# Altium schematic sheet Power_Card.SchDoc
size A3
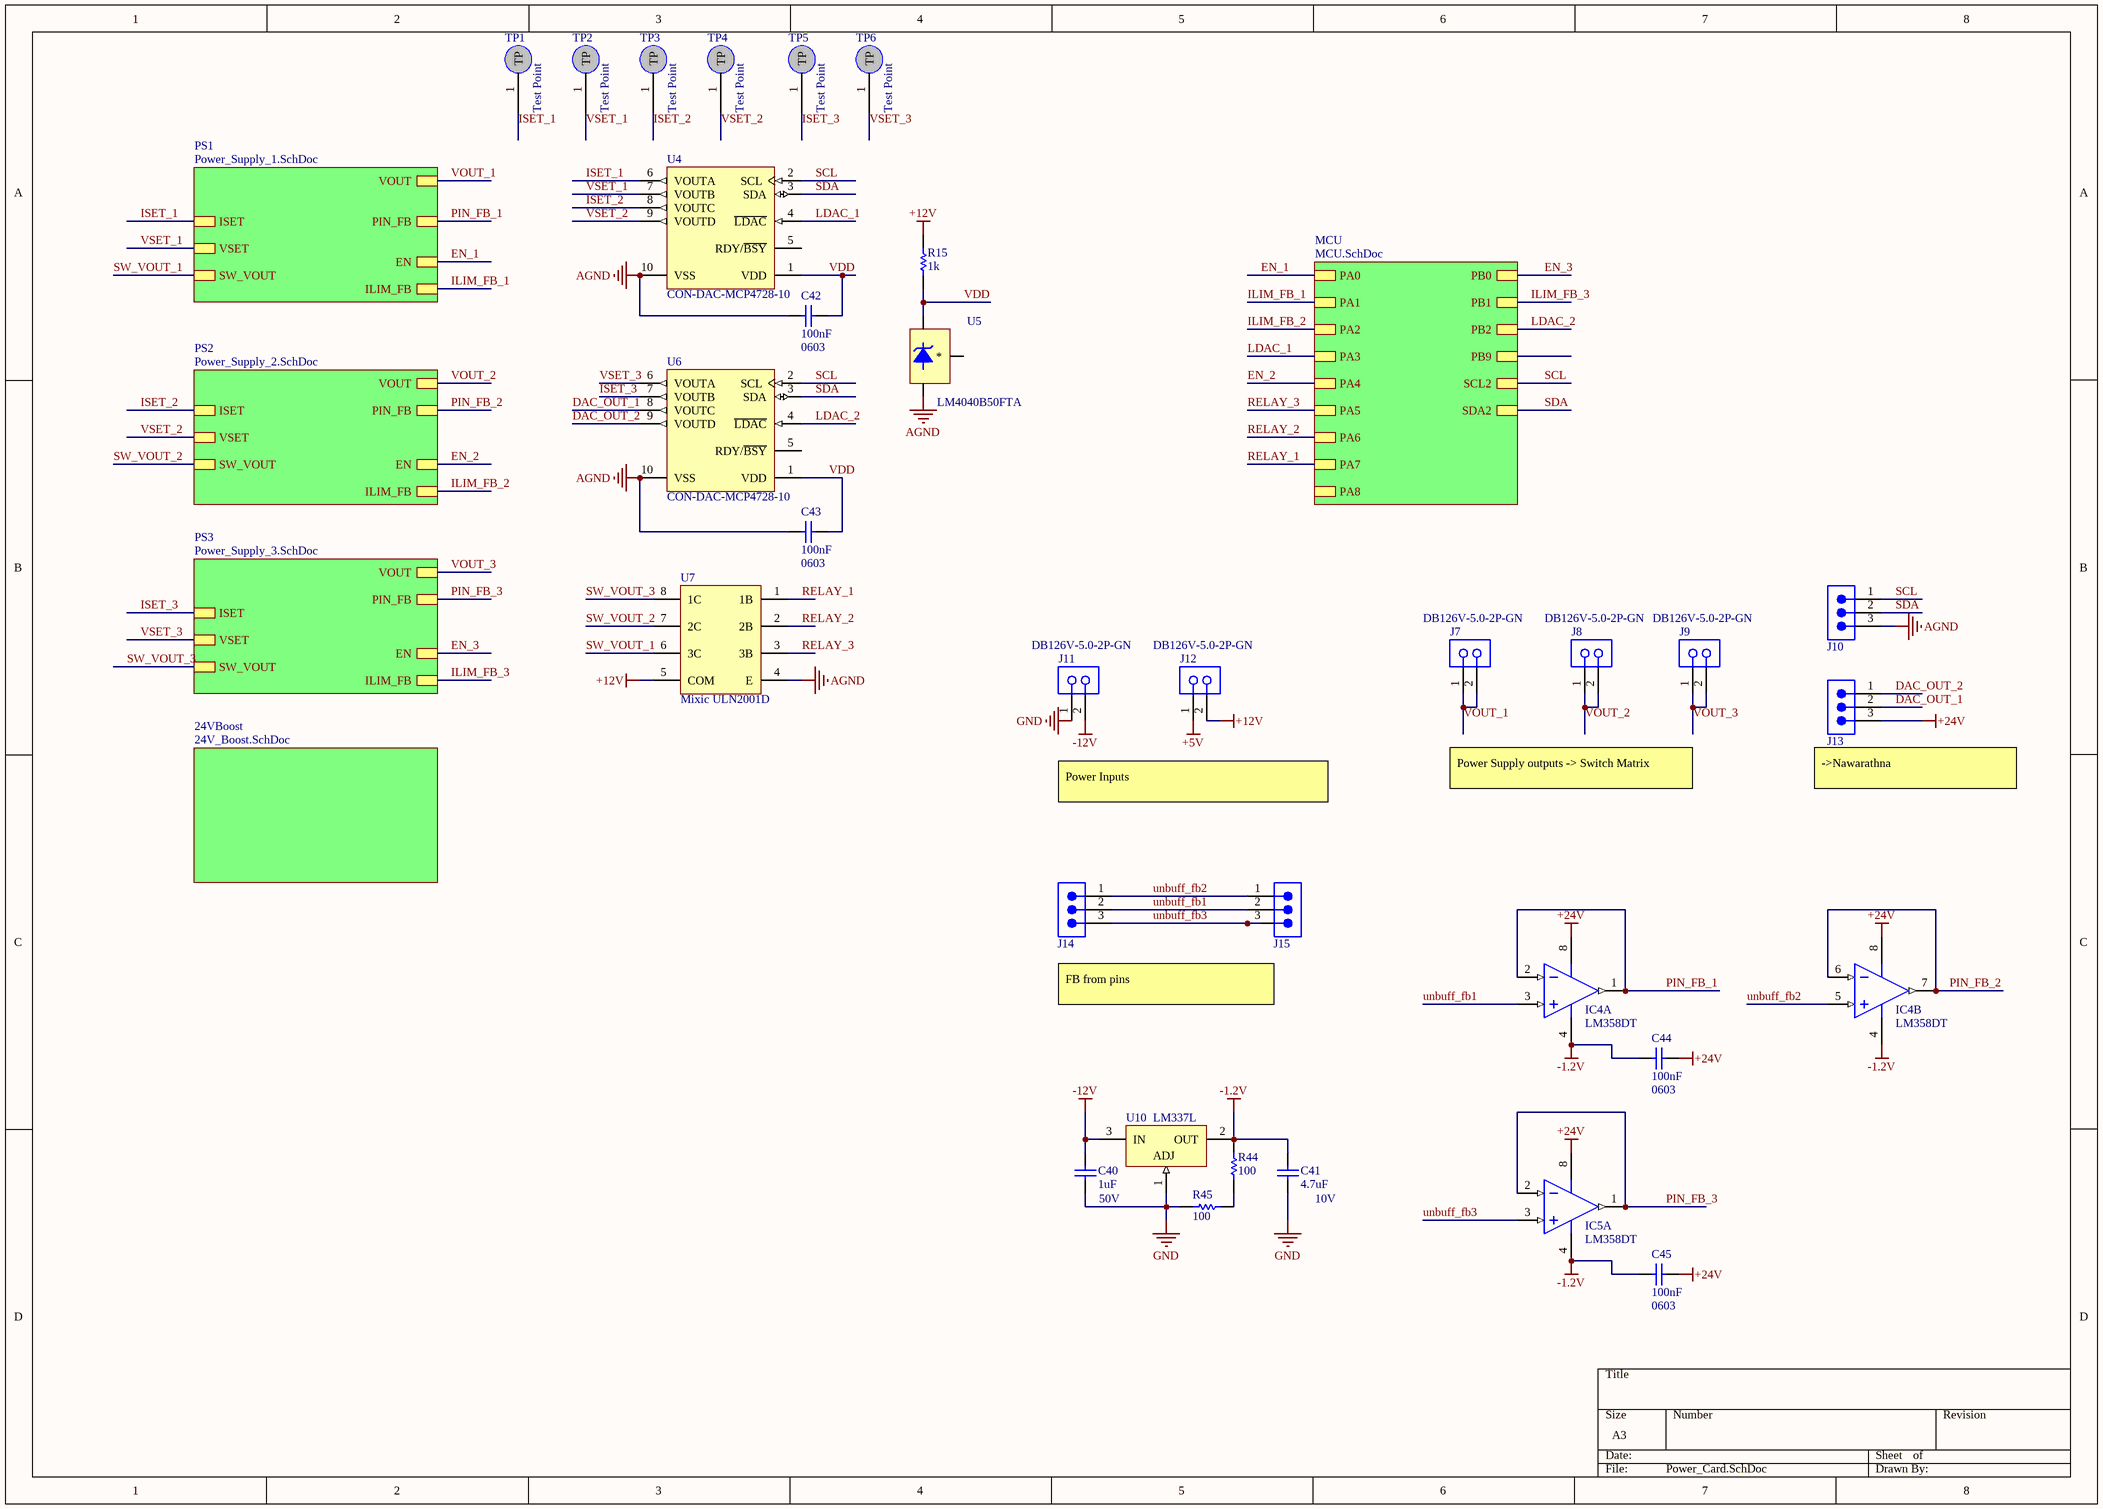
[diagram p0: Power_Card.SchDoc]

## Parts
C40  1uF  Voltage-Rated: 50V  [CAPC1608X09N]
C41  4.7uF  Voltage-Rated: 10V  [CAPC1608X09N]
C42  100nF  Package / Case: 0603  [CAPC1608X09N]
C43  100nF  Package / Case: 0603  [CAPC1608X09N]
C44  100nF  Package / Case: 0603  [CAPC1608X09N]
C45  100nF  Package / Case: 0603  [CAPC1608X09N]
IC4  LM358DT  [SOIC-OA8_M]  (parts A,B of 2)
IC5  LM358DT  [SOIC-OA8_M]  (part A of 2)
J7  DB126V-5.0-2P-GN  [PCB-kiok1jlp9o9fcwf1wwvf-1]
J8  DB126V-5.0-2P-GN  [PCB-kiok1jlp9o9fcwf1wwvf-1]
J9  DB126V-5.0-2P-GN  [PCB-kiok1jlp9o9fcwf1wwvf-1]
J10  M20-9990346  [PIN_3x1_STR (2.54mm)]  (value not drawn)
J11  DB126V-5.0-2P-GN  [PCB-kiok1jlp9o9fcwf1wwvf-1]
J12  DB126V-5.0-2P-GN  [PCB-kiok1jlp9o9fcwf1wwvf-1]
J13  M20-9990346  [PIN_3x1_STR (2.54mm)]  (value not drawn)
J14  M20-9990346  [PIN_3x1_STR (2.54mm)]  (value not drawn)
J15  M20-9990346  [PIN_3x1_STR (2.54mm)]  (value not drawn)
R15  1k  [gen0603-2]
R44  100  [gen0603-2]
R45  100  [gen0603-2]
TP1  Test Point  [PCB-76sf9akqozhr8i1vmz2c-1]
TP2  Test Point  [PCB-76sf9akqozhr8i1vmz2c-1]
TP3  Test Point  [PCB-76sf9akqozhr8i1vmz2c-1]
TP4  Test Point  [PCB-76sf9akqozhr8i1vmz2c-1]
TP5  Test Point  [PCB-76sf9akqozhr8i1vmz2c-1]
TP6  Test Point  [PCB-76sf9akqozhr8i1vmz2c-1]
U4  CON-DAC-MCP4728-10  [PCB-psrfqusngns6snaz1e8o-1]
U5  LM4040B50FTA  [PCB-bxhnyzncanvi69437o7v-1]
U6  CON-DAC-MCP4728-10  [PCB-psrfqusngns6snaz1e8o-1]
U7  Mixic ULN2001D  [PCB-pxs93rufbf6wijgtyo7d-1]
U10  LM337L  [Z03A]

## Sub-sheets
24VBoost = 24V_Boost.SchDoc: no entries
MCU = MCU.SchDoc: PA1, PA8, PB2, PB9, PA7, PA6, PA4, PA2, PA5, PA3, SDA2, PB0, PB1, SCL2, PA0
PS1 = Power_Supply_1.SchDoc: EN, VSET, VOUT, ISET, SW_VOUT, ILIM_FB, PIN_FB
PS2 = Power_Supply_2.SchDoc: VSET, EN, SW_VOUT, VOUT, ISET, ILIM_FB, PIN_FB
PS3 = Power_Supply_3.SchDoc: VSET, EN, SW_VOUT, VOUT, ISET, ILIM_FB, PIN_FB

## Nets
+5V: J12.1
+12V: J12.2 R15.2 U7.5(COM)
+24V: C44.2 C45.2 IC4.8(VCC) IC5.8(VCC) J13.3
-1.2V: C41.2 C44.1 C45.1 IC4.4(VEE/GND) IC5.4(VEE/GND) R44.1 U10.2(OUT)
-12V: C40.2 J11.2 U10.3(IN)
AGND: C42.2 C43.1 J10.3 U4.10(VSS) U5.2(-V) U6.10(VSS) U7.4(E)
GND: C40.1 C41.1 J11.1 R45.2 U10.1(ADJ)
DAC_OUT_1: J13.2 U6.8(VOUTC)
DAC_OUT_2: J13.1 U6.9(VOUTD)
EN_1: sheet PS1/EN, sheet MCU/PA0
EN_2: sheet PS2/EN, sheet MCU/PA4
EN_3: sheet PS3/EN, sheet MCU/PB0
ILIM_FB_1: sheet PS1/ILIM_FB, sheet MCU/PA1
ILIM_FB_2: sheet PS2/ILIM_FB, sheet MCU/PA2
ILIM_FB_3: sheet PS3/ILIM_FB, sheet MCU/PB1
ISET_1: TP1.1(TP) U4.6(VOUTA) ; sheet PS1/ISET
ISET_2: TP3.1(TP) U4.8(VOUTC) ; sheet PS2/ISET
ISET_3: TP5.1(TP) U6.7(VOUTB) ; sheet PS3/ISET
LDAC_1: U4.4(~{LDAC}) ; sheet MCU/PA3
LDAC_2: U6.4(~{LDAC}) ; sheet MCU/PB2
PIN_FB_1: IC4.1(OUTA) IC4.2(INA-) ; sheet PS1/PIN_FB
PIN_FB_2: IC4.6(INB-) IC4.7(OUTB) ; sheet PS2/PIN_FB
PIN_FB_3: IC5.1(OUTA) IC5.2(INA-) ; sheet PS3/PIN_FB
RELAY_1: U7.1(1B) ; sheet MCU/PA7
RELAY_2: U7.2(2B) ; sheet MCU/PA6
RELAY_3: U7.3(3B) ; sheet MCU/PA5
SCL: J10.1 U4.2(SCL) U6.2(SCL) ; sheet MCU/SCL2
SDA: J10.2 U4.3(SDA) U6.3(SDA) ; sheet MCU/SDA2
SW_VOUT_1: U7.6(3C) ; sheet PS1/SW_VOUT
SW_VOUT_2: U7.7(2C) ; sheet PS2/SW_VOUT
SW_VOUT_3: U7.8(1C) ; sheet PS3/SW_VOUT
unbuff_fb1: IC4.3(INA+) J14.2 J15.2
unbuff_fb2: IC4.5(INB+) J14.1 J15.1
unbuff_fb3: IC5.3(INA+) J14.3 J15.3
VDD: C42.1 C43.2 R15.1 U4.1(VDD) U5.3(+V) U6.1(VDD)
VOUT_1: J7.1 J7.2 ; sheet PS1/VOUT
VOUT_2: J8.1 J8.2 ; sheet PS2/VOUT
VOUT_3: J9.1 J9.2 ; sheet PS3/VOUT
VSET_1: TP2.1(TP) U4.7(VOUTB) ; sheet PS1/VSET
VSET_2: TP4.1(TP) U4.9(VOUTD) ; sheet PS2/VSET
VSET_3: TP6.1(TP) U6.6(VOUTA) ; sheet PS3/VSET
NetR44_2: R44.2 R45.1

Not connected (* = marked no-connect by the designer): U4 5(RDY/~{BSY}); U5 1(*); U6 5(RDY/~{BSY})

## Notes on the sheet
- Power Supply outputs -> Switch Matrix
- (near J13) ->Nawarathna
- Power Inputs
- FB from pins

## Library data of the parts
C40 = CMP-2f55e5122ad9f092-5: 0603 10 nF 50 V ± 10% Tolerance X7R Surface Mount Multilayer Ceramic Capacitor; Manufacture Part Number: CL21B105KBFNNNE; Manufacturer: Samsung Electro-Mechanics; Capacitance: 1uF; Package / Case: 0603; Supplier: LCSC; Supplier Part Number: C28323; Capacitance Tolerance: 10%
C41 = CMP-2f55e5122ad9f092-5: 0603 10 nF 50 V ± 10% Tolerance X7R Surface Mount Multilayer Ceramic Capacitor; Manufacture Part Number: CL10A475KP8NNNC; Manufacturer: Samsung Electro-Mechanics; Capacitance: 4.7uF; Package / Case: 0603; Supplier: LCSC; Supplier Part Number: C1705; Capacitance Tolerance: 10%
C42-C45 = CMP-2f55e5122ad9f092-5: 0603 10 nF 50 V ± 10% Tolerance X7R Surface Mount Multilayer Ceramic Capacitor; Manufacture Part Number: CC0603KRX7R9BB104; Manufacturer: YAGEO; Voltage-Rated: 50V; Capacitance Tolerance: 10%; Capacitance: 100nF; Supplier: LCSC; Supplier Part Number: C14663
IC4 IC5 = CMP-9a3c516d515145fb-3: LM358 Series 30 V 1.1 MHz Low Power Dual Operational Amplifier - SOIC-8; Manufacturer: STMicroelectronics; Slew Rate: 600 mV/μs; Number of Channels: 2; Gain Bandwidth Product: 1.10 MHz; Supply Current: 700 µA; Lead-Free Status: Lead Free; Supply Voltage (DC): 32.0 V; Lifecycle Status: Active; REACH SVHC Compliance: No SVHC; Octopart URL: https://octopart.com/lm358dt-stmicroelectronics-39579147; RoHS: Compliant; Number of Pins: 8; Bandwidth: 1.10 MHz; Number of Circuits: 2; Packaging: Cut Tape (CT), Tape & Reel (TR); Mounting Style: Surface Mount; Case/Package: SOIC; OctopartID: 9a3c516d515145fb; Manufacture Part Number: LM358DT; Supplier: LCSC; Supplier Part Number: C9418
J7-J9 J11 J12 = CMP-7ad9b3d37ed8a51e-5: Block, Terminal; 13.5 A; 250 V; 5 mm; 26 to 16 AWG; 2; Screw; Solder; 4 kV; PA; Manufacturer: DIBO; Pin pitch: 5.0mm; Manufacture Part Number: DB126V-5.0-2P-GN; Supplier: LCSC; Supplier Part Number: C395849
J10 J13-J15 = CMP-1d18d4412a33c2df-10: HARWIN M20 Series, 2.54mm Pitch 3 Way 1 Row Straight PCB Header, Solder Termination, 3A
R15 = CMP-1853278-27_16: Surface Mount Thick Film Resistor, RC Series, 1 kohm, 100 mW, - 1%, 50 V, 0603 [1608 Metric]; Manufacturer: YAGEO; Manufacture Part Number: RC0603FR-071KL; Package / Case: 0603; Resistance: 1k; Resistance Tolerance: 1%; Supplier: LCSC; Supplier Part Number: C22548
R44 R45 = CMP-1853278-27: Surface Mount Thick Film Resistor, RC Series, 1 kohm, 100 mW, - 1%, 50 V, 0603 [1608 Metric]; Manufacturer: UNI-ROYAL(Uniroyal Elec); Manufacture Part Number: 0603WAF1000T5E; Resistance Tolerance: 1%; Supplier: LCSC; Supplier Part Number: C22775; Resistance: 100; Package / Case: 0603
TP1-TP6 = CMP-90rr9i2gqvuy4eydob4k-1: TP; CustomComponentID: 90rr9i2gqvuy4eydob4k
U4 U6 = CMP-2294796-6: MCP4728 Series 4 Ch I2C EEPROM Memory 5.5 V 12-Bit D/A Converter SMT - MSOP-10; Manufacture Part Number: MCP4728-E/UN; Manufacturer: Microchip Tech; Supply Current: 800 µA; Number of Bits: 12; Octopart URL: http://octopart.com/mcp4728-e%2Fun-microchip-11800165; OctopartID: b4d07d6e9fd36b17; Mounting Style: Surface Mount; Lifecycle Status: Active; Number of Pins: 10; RoHS: Compliant; REACH SVHC Compliance: No SVHC; Supplier: LCSC; Supplier Part Number: C108207
U5 = CMP-ed9925821aa6325e-1: LM4040 Series 5 V ±0.2 % Precision Micropower Shunt Voltage Reference - SOT-23; Manufacturer: Diodes Incorporated; Temperature Coefficient: 20.0 ppm/°C; Supplier: LCSC; Supplier Part Number: C460606; Manufacture Part Number: LM4040B50FTA
U7 = CMP-uwgrh96kdeedshkgggct-4: Darlington transistor array driver; CustomComponentID: uwgrh96kdeedshkgggct; Manufacturer: Mixic; Manufacture Part Number: ULN2001D; Supplier: LCSC; Supplier Part Number: C108905
U10 = LM337LZ/NOPB: 3-Terminal Adjustable Regulator, 3-pin TO-92, Pb-Free; Manufacturer: Texas Instruments; Current Rating: 1.0 A; Dropout Voltage: 0.003 V; Lead-Free Status: Lead Free; Number of Outputs: 1; Output Current: 0.1 A; Case/Package: SOIC; Lifecycle Status: Active; Mounting Style: Through Hole; Number of Pins: 3; Number of Regulated Outputs: 1; Octopart Url: https://octopart.com/lm337lz%2Fnopb-texas+instruments-24813737; OctopartID: cd28055848e712ef; Packaging: Box; REACH SVHC Compliance: No SVHC; RoHS: Compliant; Manufacture Part Number: LM337LZ/NOPB; Supplier: LCSC; Supplier Part Number: C33082